# Altium schematic sheet BLE.SchDoc
size A
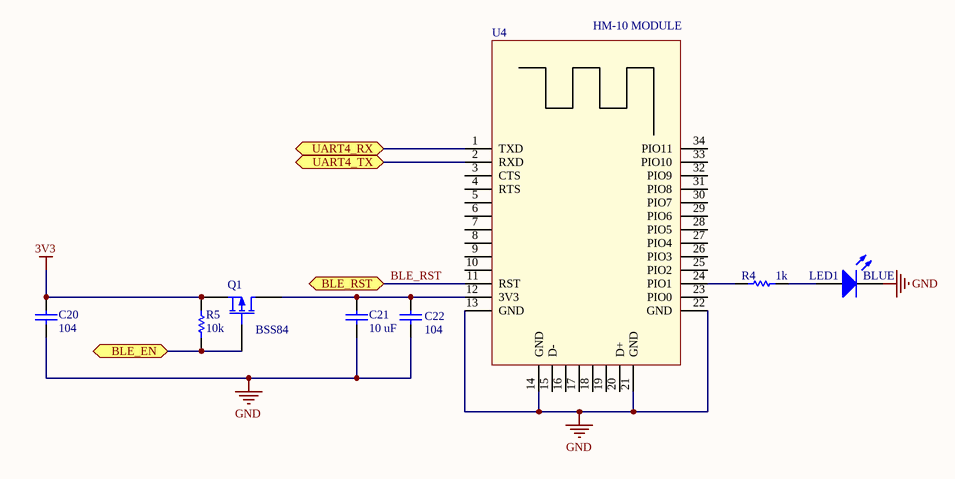
[diagram p0: BLE.SchDoc]

## Parts
C20  104  [C0603]
C21  10 uF  [C1210]
C22  104  [C0603]
LED1  BLUE  [SM/LED_0603]
Q1  BSS84  [SOT23-3]
R4  1k  [R0603]
R5  10k  [R0603]
U4  HM-10 MODULE  [HC-05 BREAKOUT]

## Ports
BLE_EN, BLE_RST, UART4_RX, UART4_TX

## Nets
3V3: C20.2 Q1.2(S) R5.1
GND: C20.1 C21.1 C22.1 LED1.2(K) U4.13(GND) U4.14(GND) U4.21(GND) U4.22(GND)
BLE_EN: Q1.1(G) R5.2 ; port BLE_EN
BLE_RST: U4.11(RST) ; port BLE_RST
UART4_RX: U4.1(TXD) ; port UART4_RX
UART4_TX: U4.2(RXD) ; port UART4_TX
NetC21_2: C21.2 C22.2 Q1.3(D) U4.12(3V3)
NetLED1_1: LED1.1(A) R4.2
NetR4_1: R4.1 U4.24(PIO1)

Not connected (* = marked no-connect by the designer): U4 3(CTS) 4(RTS) 5 6 7 8 9 10 15(D-) 16 17 18 19 20(D+) 23(PIO0) 25(PIO2) 26(PIO3) 27(PIO4) 28(PIO5) 29(PIO6) 30(PIO7) 31(PIO8) 32(PIO9) 33(PIO10) 34(PIO11)

## Library data of the parts
C20-C22 = Cap_SMT: CAP CER 0.1UF 16V Y5V 0402; Manufacturer: Yageo; Manufacturer Part Number: CC0603ZRY5V7BB104; Published: 8-Jun-2000; LatestRevisionDate: 17-Jul-2002; LatestRevisionNote: Re-released for DXP Platform.; PackageReference: C0603; Publisher: Altium Limited; Digi-Key Part Number: 311-1047-1-ND; Unit Price: 0.00648
  C20 C22: Value: 104
  C21: Value: 10 uF
LED1 = LED: LED GREEN 0.2MM 13MCD 0402 SMD; Manufacturer: Lite-On Inc; Manufacturer Part Number: LTST-C191KGKT; Published: 8-Jun-2000; LatestRevisionDate: 17-Jul-2002; LatestRevisionNote: Re-released for DXP Platform.; PackageVersion: Feb-2002; PackageReference: 3.2X1.6X1.1; Publisher: Altium Limited; Digi-Key Part Number: 511-1592-2-ND; Unit Price: 0.03780; Value: LED GREEN
Q1 = MOSFET-P GSD: MOSFET P-CH 50V 130MA SOT23-3; Manufacturer: Diodes Inc; Manufacturer Part Number: BSS84-7-F; Published: 8-Jun-2000; LatestRevisionDate: 17-Jul-2002; LatestRevisionNote: Re-released for DXP Platform.; PackageVersion: 1995/1996; PackageReference: E3; Publisher: Altium Limited; Digi-Key Part Number: BSS84-FDITR-ND; Unit Price: 0.06000
R4 = R_SMD1: Resistor SMD 1%; Manufacturer: Panasonic Electronic Components; Manufacturer Part Number: ERJ-2RKF3241X; Published: 8-Jun-2000; LatestRevisionDate: 17-Jul-2002; LatestRevisionNote: Re-released for DXP Platform.; PackageReference: R0603; Publisher: Altium Limited; Digi-Key Part Number: P3.24KLTR-ND; Unit Price: 0.00203; Value: 1k
R5 = R_SMD5: Resistor SMD 5%; Manufacturer: Panasonic Electronic Components; Manufacturer Part Number: ERJ-2RKF3241X; Published: 8-Jun-2000; LatestRevisionDate: 17-Jul-2002; LatestRevisionNote: Re-released for DXP Platform.; PackageReference: R0603; Publisher: Altium Limited; Digi-Key Part Number: P3.24KLTR-ND; Unit Price: 0.00203; Value: 10k